# EAGLE design irs-takachi (EAGLE 7.6.0)
CNAME: IRS sensor (RFM69HW); CREVISION: 1; DESIGNER: Dariusz Mazur
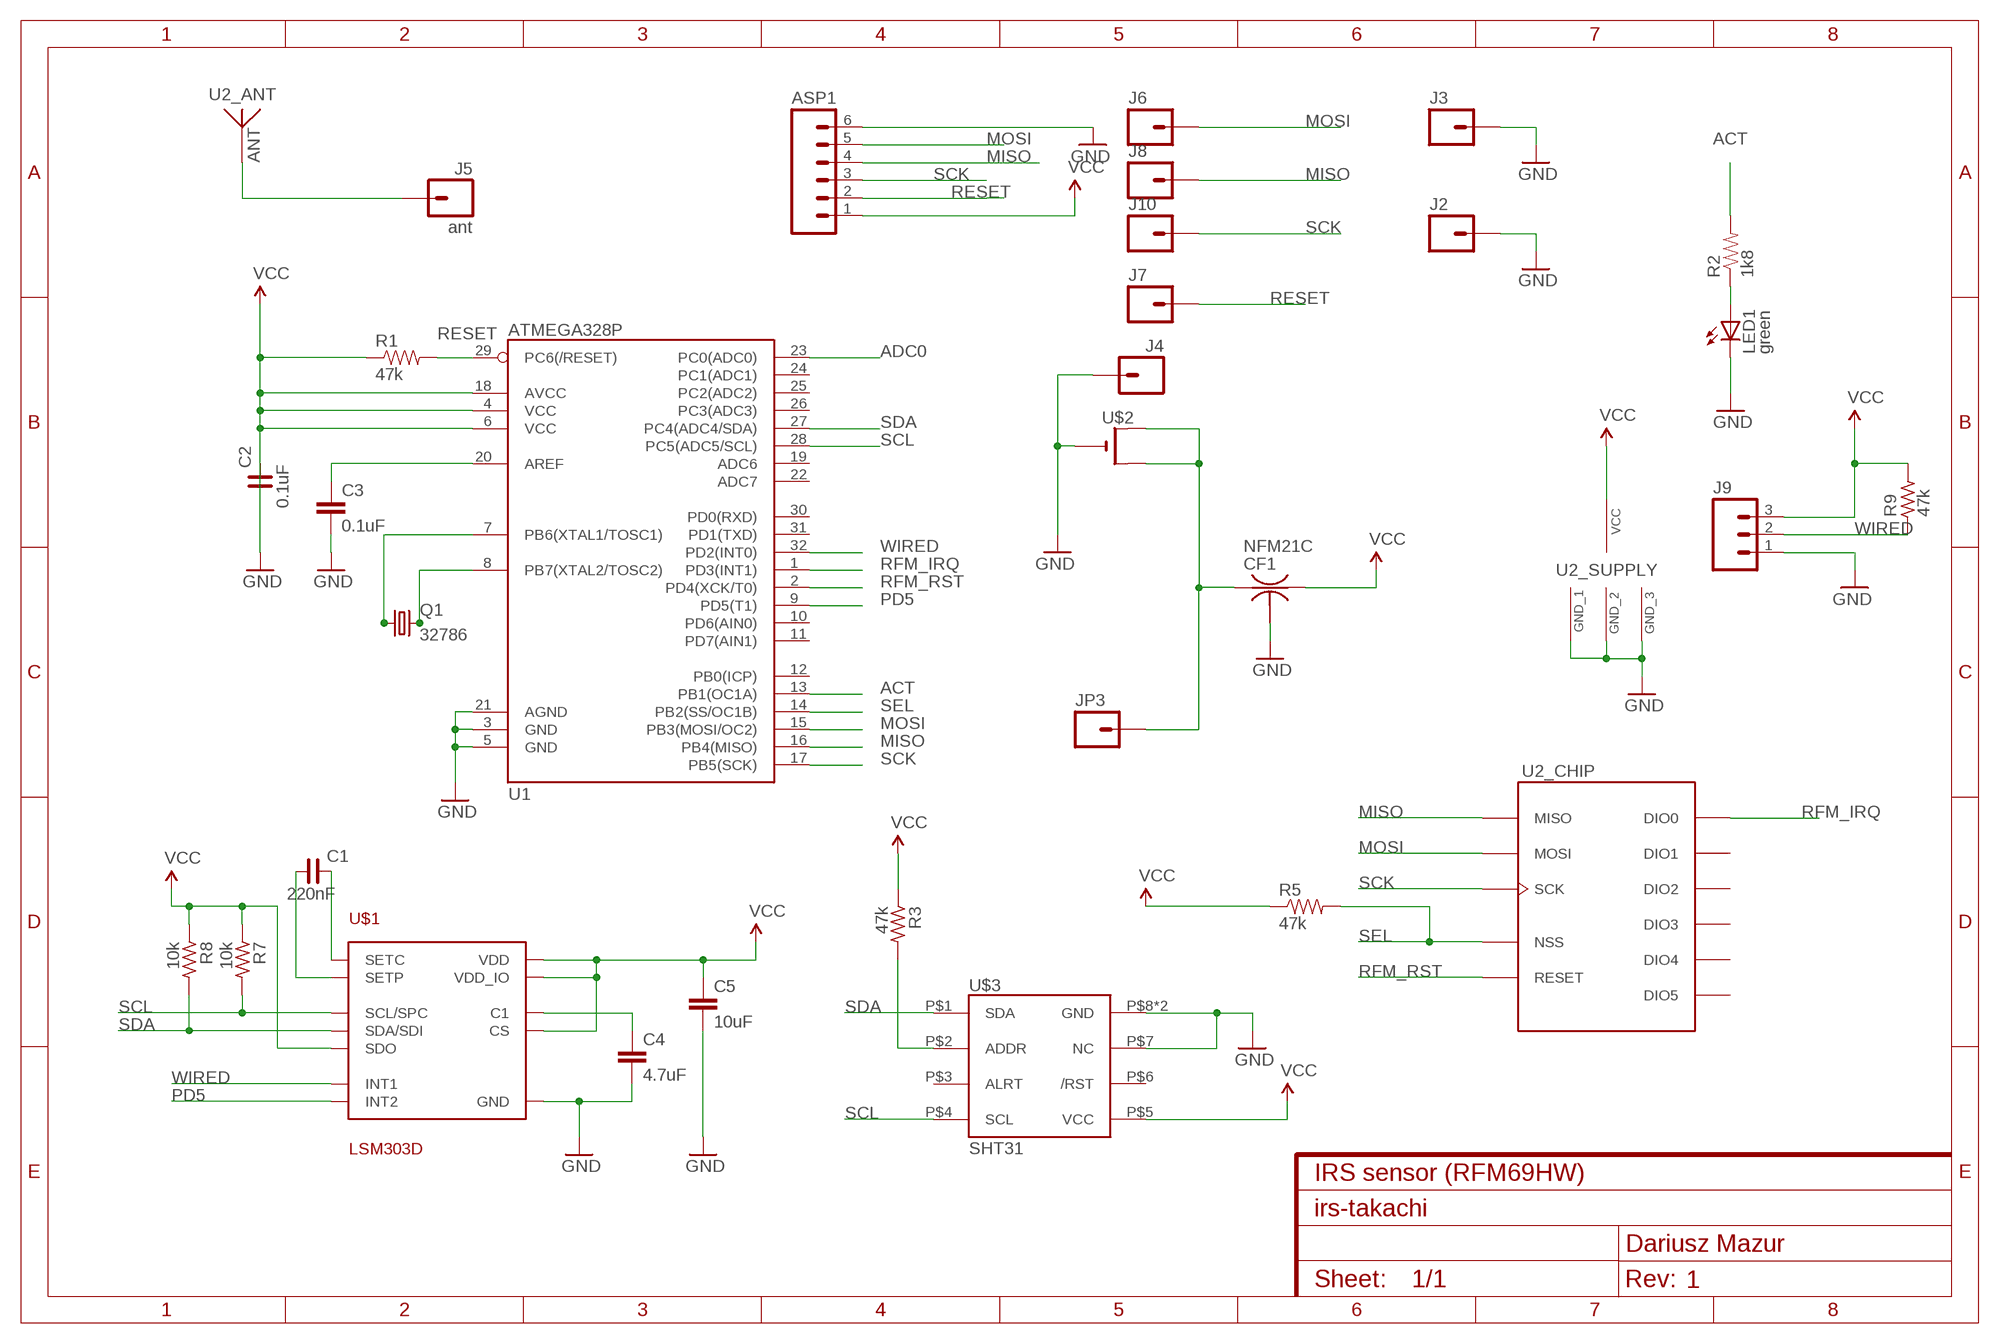
[diagram p0: schematic, sheet 1]

## Parts
ASP1  M06NO_SILK_YES_STOP  [1X06_NO_SILK_YES_STOP]
C1  220nF  C_0603  [C0603]
C2  0.1uF  C_0603  [C0603]
C3  0.1uF  0.1UF-25V(+80/-20%)(0603)  [0603-CAP]
C4  4.7uF  C-EUC0603K  [C0603K]
C5  10uF  10UF10V10%(0805)  [0805-CAP]
CF1  NFM21C  [NFM21C]
J2  M01PTH_NO_SILK_YES_STOP  [1X01_NO_SILK]
J3  M01PTH_NO_SILK_YES_STOP  [1X01_NO_SILK]
J4  M01SNAP-FEMALE  [SNAP-FEMALE]
J5  ant  M01PTH_NO_SILK_YES_STOP  [1X01_NO_SILK]
J6  M01SMD-4.5X1.5  [PAD-1.5X4.5]
J7  M01SMD-4.5X1.5  [PAD-1.5X4.5]
J8  M01SMD-4.5X1.5  [PAD-1.5X4.5]
J9  M031X03_NO_SILK  [1X03_NO_SILK]
J10  M01SMD-4.5X1.5  [PAD-1.5X4.5]
JP3  M01SMDNS  [1X01NS]
LED1  green  LED0603  [LED-0603]
Q1  32786  MC-306  [MC-306]
R1  47k  RESISTOR0603-RES  [0603-RES]
R2  1k8  RESISTOR0603-RES  [0603-RES]
R3  47k  R_0603  [R0603]
R5  47k  RESISTOR0603-RES  [0603-RES]
R7  10k  R_0603  [R0603]
R8  10k  R_0603  [R0603]
R9  47k  R_0603  [R0603]
U1  ATMEGA328P  ATMEGA328_SMT  [TQFP32-08]
U2  RFM69HCW-S2  [HOPE-RF-16]
U$1  LSM303D  [LGA16-3MM]
U$2  CR2032THM  [CR2032-THRU]
U$3  SHT31  SHT31-DIS  [SHT3X]

## Nets
ACT: R2.2 U1.13(PB1(OC1A))
ADC0: U1.23(PC0(ADC0))
GND: ASP1.6 C2.2 C3.2 C4.2 C5.2 CF1.2@1 J2.1 J3.1 J4.1 J9.1 LED1.C U1.3(GND) U1.5(GND) U1.21(AGND) U2.GND1(_SUPPLY:GND_1) U2.GND2(_SUPPLY:GND_2) U2.GND3(_SUPPLY:GND_3) U$1.5(GND) U$1.10(GND) U$1.12(GND) U$1.13(GND) U$1.16(GND) U$2.- U$3.P$7(NC) U$3.P$8(GND) U$3.PAD(GND)
MISO: ASP1.4 J8.P$1 U1.16(PB4(MISO)) U2.MISO(_CHIP:MISO)
MOSI: ASP1.5 J6.P$1 U1.15(PB3(MOSI/OC2)) U2.MOSI(_CHIP:MOSI)
N$1: LED1.A R2.1
N$2: CF1.1 JP3.1 U$2.+1(+) U$2.+2(+1)
N$3: J5.1 U2.ANT(_ANT:ANT)
N$4: C3.1 U1.20(AREF)
N$5: Q1.1 U1.7(PB6(XTAL1/TOSC1))
N$6: Q1.4 U1.8(PB7(XTAL2/TOSC2))
N$12: C1.1 U$1.3(SETP)
N$13: C1.2 U$1.2(SETC)
N$14: C4.1 U$1.15(C1)
N$15: R3.2 U$3.P$2(ADDR)
PD5: U1.9(PD5(T1)) U$1.9(INT2)
RESET: ASP1.2 J7.P$1 R1.2 U1.29(PC6(/RESET))
RFM_IRQ: U1.1(PD3(INT1)) U2.DIO0(_CHIP:DIO0)
RFM_RST: U1.2(PD4(XCK/T0)) U2.RESET(_CHIP:RESET)
SCK: ASP1.3 J10.P$1 U1.17(PB5(SCK)) U2.SCK(_CHIP:SCK)
SCL: R7.2 U1.28(PC5(ADC5/SCL)) U$1.4(SCL/SPC) U$3.P$4(SCL)
SDA: R8.2 U1.27(PC4(ADC4/SDA)) U$1.6(SDA/SDI) U$3.P$1(SDA)
SEL: R5.2 U1.14(PB2(SS/OC1B)) U2.NSS(_CHIP:NSS)
VCC: ASP1.1 C2.1 C5.1 CF1.3 J9.3 R1.1 R3.1 R5.1 R7.1 R8.1 R9.2 U1.4(VCC) U1.6(VCC) U1.18(AVCC) U2.3.3V(_SUPPLY:VCC) U$1.1(VDD_IO) U$1.7(SDO) U$1.8(CS) U$1.14(VDD) U$3.P$5(VCC)
WIRED: J9.2 R9.1 U1.32(PD2(INT0)) U$1.11(INT1)
Unconnected: CF1.2@2 U1.10(PD6(AIN0)) U1.11(PD7(AIN1)) U1.12(PB0(ICP)) U1.19(ADC6) U1.22(ADC7) U1.24(PC1(ADC1)) U1.25(PC2(ADC2)) U1.26(PC3(ADC3)) U1.30(PD0(RXD)) U1.31(PD1(TXD)) U2.DIO1(_CHIP:DIO1) U2.DIO2(_CHIP:DIO2) U2.DIO3(_CHIP:DIO3) U2.DIO4(_CHIP:DIO4) U2.DIO5(_CHIP:DIO5) U$3.P$3(ALRT) U$3.P$6(/RST)

## Library data of the parts
ASP1 = SparkFun-Connectors:M06: Header 6 Standard 6-pin 0.1" header. Use with straight break away headers (SKU : PRT-00116), right angle break away headers (PRT-00553), swiss pins (PRT-00743), machine pins (PRT-00117), and female headers (PRT-00115). Molex polarized connector foot print use with SKU : PRT-08094 with associated crimp pins and housings. NOTES ON THE VARIANTS LOCK and LOCK_LONGPADS... This footprint was designed to help hold the alignment of a through-hole component (i.e. 6-pin header) while soldering it into place. You may notice that each hole has been shifted either up or down by 0.005 of an inch from it's more standard position (which is a perfectly straight line). This slight alteration caused the pins (the squares in the middle) to touch the edges of the holes. Because they are alternating, it causes a "brace" to hold the component in place. 0.005 has proven to be the perfect amount of "off-center" position when using our standard breakaway headers. Although looks a little odd when you look at the bare footprint, once you have a header in there, the alteration is very hard to notice. Also,if you push a header all the way into place, it is covered up entirely on the bottom side. This idea of altering the position of holes to aid alignment will be further integrated into the Sparkfun Library for other footprints. It can help hold any component with 3 or more connection pins.
C1 C2 = rc-master-smd:C_: NON-POLARIZED CAP
C3 = SparkFun-Capacitors:0.1UF-25V(+80/-20%)(0603): CAP-00810 Ceramic Standard decoupling cap; PROD_ID: CAP-00810
C4 = resistor:C-EU: CAPACITOR, European symbol
C5 = SparkFun-Capacitors:10UF10V10%(0805): CAP-11330; PROD_ID: CAP-11330
CF1 = murata-filter:NFM: EMIFIL(R) (Capacitor type) Single Circuit Type for Signal Lines Source: http://search.murata.co.jp/Ceramy/image/img/PDF/ENG/L0111S0109NFM3DC.pdf; MPN: NFM21CC102R1H3D; OC_FARNELL: 1828795; OC_NEWARK: 84R0165
J2-J8 J10 JP3 = SparkFun-Connectors:M01: Header 1 Standard 1-pin 0.1" header. Use with straight break away headers (SKU : PRT-00116), right angle break away headers (PRT-00553), swiss pins (PRT-00743), machine pins (PRT-00117), and female headers (PRT-00115). SMTSO-256-ET is a "flush mount" nut for a 4-40 screw. The older package used to be too tight, and did not allow it to sit properly thru the drill hit. The latest (0.165DIA) fits nice and snug.
J9 = SparkFun-Connectors:M03: Header 3 Standard 3-pin 0.1" header. Use with straight break away headers (SKU : PRT-00116), right angle break away headers (PRT-00553), swiss pins (PRT-00743), machine pins (PRT-00117), and female headers (PRT-00115). Molex polarized connector foot print use with SKU : PRT-08232 with associated crimp pins and housings.
LED1 = SparkFun-LED:LED: LEDs Standard schematic elements and footprints for 5mm, 3mm, 1206, and 0603 sized LEDs. 5mm - Spark Fun Electronics SKU : COM-00529 (and others)
Q1 = crystal:MC-306: kHz RANGE CRYSTAL UNIT SMD Source: MC-306_405_406_E07X.PDF Homepage <http://www.epsontoyocom.co.jp>; MPN: MC-306 60.0KHZ 100PPM ,12.5PF; OC_FARNELL: 1278040; OC_NEWARK: 31M5576
R1 R2 R5 = SparkFun-Passives:RESISTOR: Resistor Basic schematic elements and footprints for 0603, 1206, and PTH resistors.
R3 R7-R9 = rc-master-smd:R_: RESISTOR
U1 = SparkFun-DigitalIC:ATMEGA328_SMT: 32-Pin Atmega328 part Commonly used on Arduino compatible boards Available in QFP and QFN packages TQFP is IC-09069 QFN is non-stock; PROD_ID: IC-09069
U2 = icmi-custom-parts:RFM69HCW: HopeRF RFM69HCW ISM Transceiver Module The RFM69HCW <http://www.hoperf.com/rf/fsk_module/RFM69HCW.htm> is a transceiver module capable of operation over a wide frequency range, including the 315,433,868 and 915MHz license-free ISM (Industry Scientific and Medical) frequency bands. All major RF communication parameters are programmable and most of them can be dynamically set. The RFM69HCW offers the unique advantage of programmable narrow-band and wide- band communication modes. The RFM69HCW is optimized for low power consumption while offering high RF output power and channelized operation. Compliance ETSI and FCC regulations. In order to better use RFM69HCW modules, this specification also involves a large number of the parameters and functions of its core chip RF69H's,including those IC pins which are not leaded out. All of these can help customers gain a better understanding of the performance of RFM69HCW modules, and enhance the application skills.
U$1 = pimoroni-ics:LSM303D
U$2 = adafruit:CR2032
U$3 = thomasb9511:SHT31-DIS

## Board
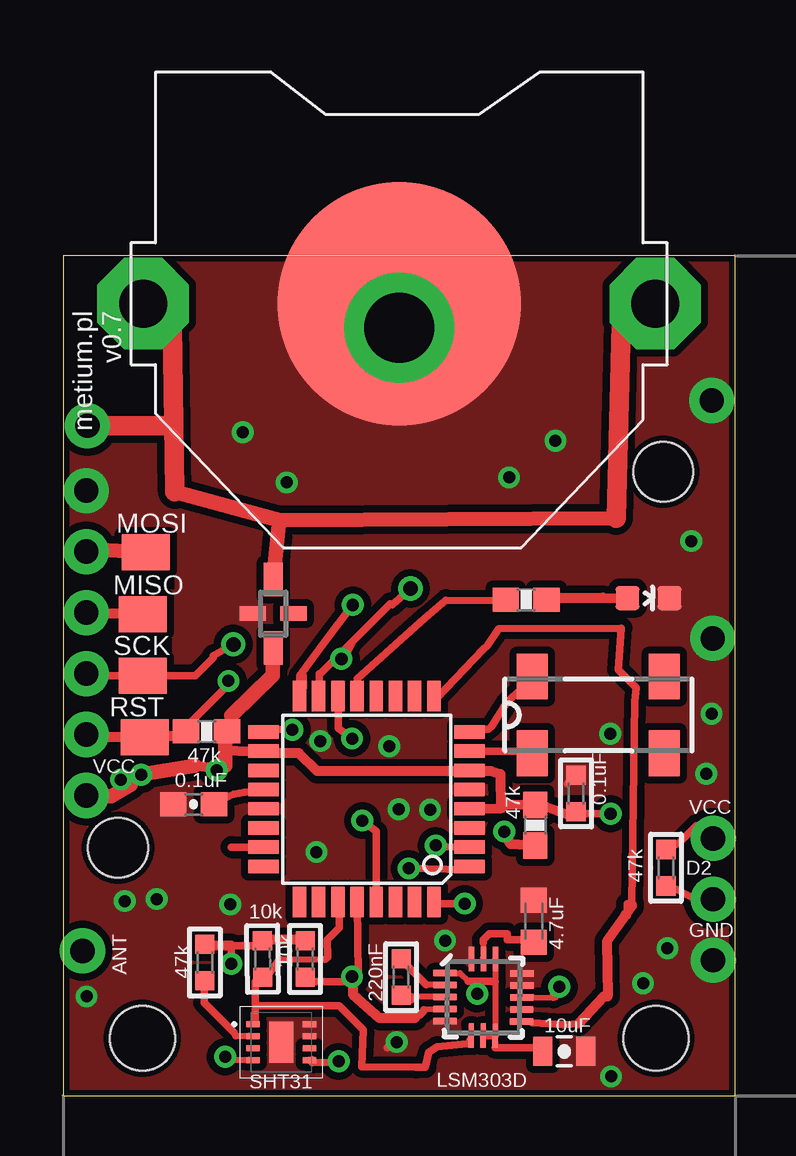
[diagram p1: board, top side]
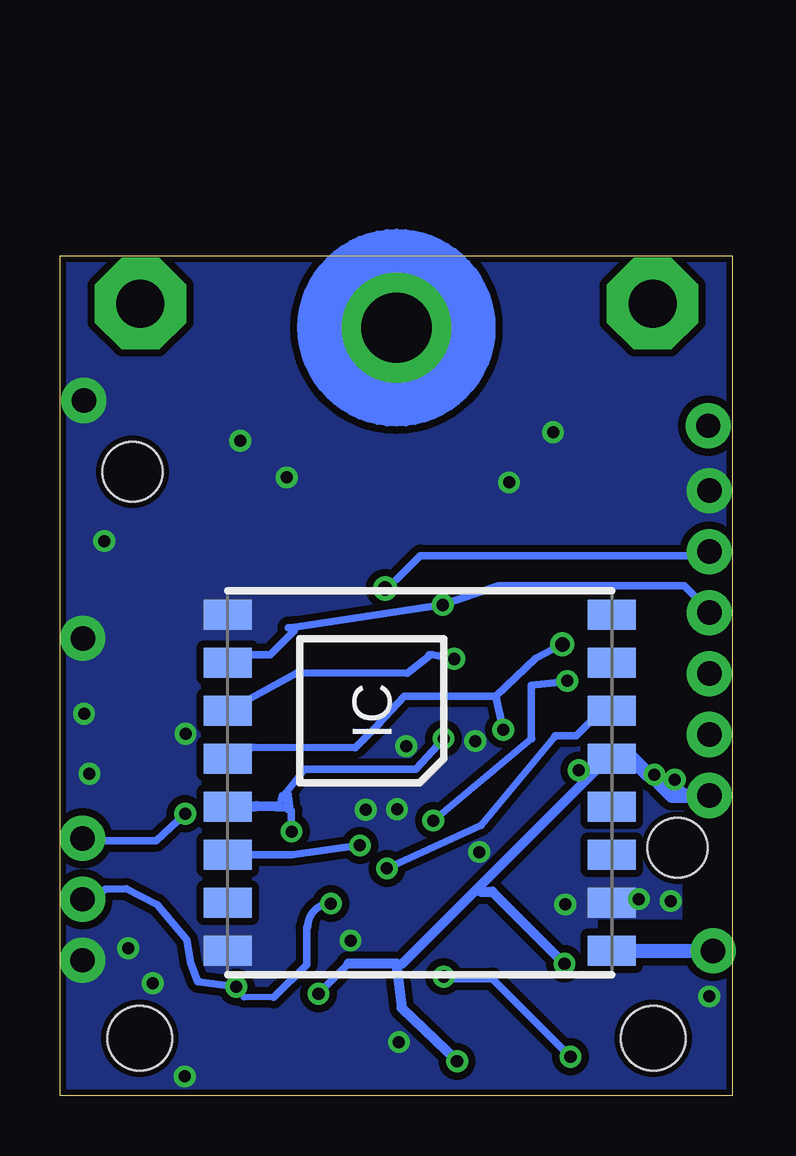
[diagram p2: board, bottom side, seen from below]

Size 28 x 35 mm. Coordinates in mm from the lower left corner, seen from the top.
Outline: 0,0 28,0 28,35 0,35 0,0
Copper layers (1*16): Top 0.035mm / dielectric 1.5mm / Bottom 0.035mm
Design rules "dirt_cheap_dirty_boards.v1 *": minimum track width 12mil, minimum drill 20mil, track to track 12mil, track to pad 12mil, pad to pad 10mil, via to via 12mil, smd to smd 0mil, copper to edge 10mil, drill to drill 12mil, minimum pad ring 12mil, minimum via ring 8mil, stop-mask expansion 2mil, vias tented up to drill 25mil, thermal gap 10mil
Holes 2.5 mm at 25,26 2.28,10.33
Holes 2.7 mm at 3.3,2.4 24.7,2.4
tRestrict: area 2.4,21.1 to 4.6,21.7; area 2.3,18.5 to 4.5,19.1; area 24.6,9.3 to 25.9,9.6
bRestrict: area 20,8.8 to 22.1,9.2; area 19.6,12.9 to 22.1,13.2; area 20.1,10.9 to 22.1,11.2; area 3.4,14.8 to 5.5,15.2; area 3.5,18.8 to 5.5,19.2; area 3.5,16.8 to 5.5,17.2; area 0,6.9 to 5.6,7.3; area 20,14.8 to 22.1,15.2; area 0,6.3 to 2.1,11; area 20,16.8 to 22.1,17.2

### Footprints (pad centres in the part's own frame; a part is rotated, then mirrored left to right if it is on the bottom)
1X06_NO_SILK_YES_STOP = drill 1.016 pad 1.88: 1 0,0; 2 2.54,0; 3 5.08,0; 4 7.62,0; 5 10.16,0; 6 12.7,0
C0603 = smd 0.8 x 0.8: 1 -0.762,0; 2 0.762,0
0603-CAP = smd 1.1 x 1: 1 -0.85,0; 2 0.85,0
C0603K = smd 1.05 x 1.08: 1 -0.875,0; 2 0.875,0
0805-CAP = smd 0.8 x 1.2: 1 -0.9,0; 2 0.9,0
NFM21C = smd 1.4 x 0.8: 1 -1.425,0; 3 1.425,0 | smd 0.6 x 1.1: 2@1 0,-0.85; 2@2 0,0.85
1X01_NO_SILK = drill 1.016 pad 1.88: 1 0,0
SNAP-FEMALE = drill 2.921 pad 4.572: 1 0,0
PAD-1.5X4.5 = smd 1.5 x 2: P$1 0,0
1X03_NO_SILK = drill 1.016 pad 1.88: 1 0,0; 2 2.54,0; 3 5.08,0
1X01NS = drill 1.016 pad 1.88: 1 0,0
LED-0603 = smd 1 x 1: A 0,-0.877; C 0,0.877
MC-306 = smd 1.3 x 1.9: 1 -2.75,-1.6; 2 2.75,-1.6; 3 2.75,1.6; 4 -2.75,1.6
0603-RES = smd 1.1 x 1: 1 -0.85,0; 2 0.85,0
R0603 = smd 0.8 x 0.8: 1 -0.762,0; 2 0.762,0
TQFP32-08 = smd 1.27 x 0.559: 1 -4.293,2.8; 2 -4.293,2; 3 -4.293,1.2; 4 -4.293,0.4; 5 -4.293,-0.4; 6 -4.293,-1.2; 7 -4.293,-2; 8 -4.293,-2.8; 17 4.293,-2.8; 18 4.293,-2; 19 4.293,-1.2; 20 4.293,-0.4; 21 4.293,0.4; 22 4.293,1.2; 23 4.293,2; 24 4.293,2.8 | smd 0.559 x 1.27: 9 -2.8,-4.293; 10 -2,-4.293; 11 -1.2,-4.293; 12 -0.4,-4.293; 13 0.4,-4.293; 14 1.2,-4.293; 15 2,-4.293; 16 2.8,-4.293; 25 2.8,4.293; 26 2,4.293; 27 1.2,4.293; 28 0.4,4.293; 29 -0.4,4.293; 30 -1.2,4.293; 31 -2,4.293; 32 -2.8,4.293
HOPE-RF-16 = smd 1.25 x 2: 3.3V 1,-8; ANT -7,-8; DIO0 3,-8; DIO1 5,-8; DIO2 7,-8; DIO3 -3,-8; DIO4 -1,-8; DIO5 -5,8; GND1 7,8; GND2 -7,8; GND3 -5,-8; MISO 5,8; MOSI 3,8; NSS -1,8; RESET -3,8; SCK 1,8
LGA16-3MM = smd 1 x 0.25: 1 -1.6,1; 2 -1.6,0.5; 3 -1.6,0; 4 -1.6,-0.5; 5 -1.6,-1; 9 1.6,-1; 10 1.6,-0.5; 11 1.6,0; 12 1.6,0.5; 13 1.6,1 | smd 0.25 x 1: 6 -0.5,-1.6; 7 0,-1.6; 8 0.5,-1.6; 14 0.5,1.6; 15 0,1.6; 16 -0.5,1.6
CR2032-THRU = drill 2 pad 3.81 octagon: +1 -10.668,0; +2 10.668,0 | smd 10.16 x 10.16: - 0,0
SHT3X = smd 0.55 x 0.25: P$1 -1.175,0.75; P$2 -1.175,0.25; P$3 -1.175,-0.25; P$4 -1.175,-0.75; P$5 1.175,-0.75; P$6 1.175,-0.25; P$7 1.175,0.25; P$8 1.175,0.75 | smd 1 x 1.7: PAD 0,0

### Placement (x,y rotation side)
ASP1  0.96,12.51 90 bottom
C1  14.08,4.94 90 top
C2  21.37,12.6 90 top
C3  5.43,12.15 180 top
C4  19.61,7.27 90 top
C5  20.88,1.85 0 top
CF1  8.75,20.09 270 top
J2  27.07,19.06 90 top
J3  27.03,28.97 0 top
J4  14,32 0 bottom
J5  0.81,6.04 0 top
J6  3.45,22.64 90 top
J7  3.41,14.93 90 top
J8  3.32,20.05 90 top
J9  27.08,5.64 90 top
J10  3.31,17.49 90 top
JP3  1.01,27.91 90 top
LED1  24.39,20.73 270 top
Q1  22.3,15.87 0 top
R1  5.97,15.18 180 top
R2  19.29,20.67 180 top
R3  5.9,5.55 270 top
R5  19.67,11.27 270 top
R7  10.08,5.7 270 top
R8  8.31,5.7 270.7 top
R9  25.12,9.5 90 top
U1  12.65,12.36 180 top
U2  13.03,13.04 90 bottom
U$1  17.51,4.1 359.7 top
U$2  14,33 0 top
U$3  9.09,2.23 0 top

### Tracks (layer width: path | path; a pad name or v marks a point on that pad's centre or on a via)
ACT
  Top 0.305: R2.2 18.5,20.62 15.94,20.65 15.06,19.9 12.25,17.38 12.25,16.75 U1.13
ADC0
  Top 0.305: 8.2,10.37 U1.23 7.01,10.36
GND  (via drill 0.5, 0.5 pad 0.25)
  Top 0.305: U1.21 | 21,13 C2.2 | 13.5,2 v13.9,2.24
  other vias: 2.57,8.11 0.97,4.14 6.96,7.97 26.17,23.11 13.98,11.94 27.02,15.91 15.28,11.91 22.79,15.09 10.55,10.15 13.59,14.57 10.71,14.78 7.48,27.64 26.79,13.42 25.17,6.14 24.16,4.69 15.91,6.46 20.51,27.29 22.83,0.8 3.9,8.19 18.58,25.76 9.31,25.55
  pour Bottom (rank 6, no thermals): 0,35 28,35 28,0 0,0
  pour Top (rank 6, no thermals): 0,0 28,0 28,35 0,35
MISO  (via drill 0.51)
  Top 0.305: 9.85,17.5 10.89,18.91 v12.07,20.45 | 9.85,17.5 9.85,17.14 | J8.P$1 3.5,20.25 3.43,20.1 | 1,20.12 ASP1.4 1,20 1,20.1 | U1.16 10,17 10,17.5 9.85,17.5
  Top 0.406: 0.93,20.1 1,20.1 3.43,20.1
  Bottom 0.305: 18.5,19.5 18.27,19.52 | 18.27,19.52 v12.07,20.45 9.75,21.25 2,21.25 1,20.25 ASP1.4 | U2.MISO 20.88,18.25 20.75,18.38 19.25,18.38 18.25,19.38 18.27,19.52
MOSI  (via drill 0.51, 0.6)
  Top 0.305: v14.47,21.13 13.71,20.45 13.62,20.5 12.06,18.94 | U1.15 10.68,17.59 10.75,17.62 12.06,18.94 | 1.41,22.75 1.12,22.75 1,22.75 ASP1.5 | 12.06,18.94 11.84,18.46 v11.59,18.2
  Top 0.61: J6.P$1 1.49,22.74 1.41,22.75
  Bottom 0.254: 1,22.5 ASP1.5
  Bottom 0.305: U2.MOSI 18.14,17.63 13.56,17.6 12.7,18.27 12.62,18.38 12.5,18.38 v11.59,18.2 | v14.47,21.13 14,21.5 13,22.5 1,22.5
N$1
  Top 0.305: 20.25,20.75 R2.1
  Top 0.406: 20.25,20.75 22.5,20.75 LED1.A
N$2
  Top 0.305: 4.5,28 4.62,27.88 | 4.5,28 4.5,27.91 | 4.5,28 4.61,28
  Top 0.406: 4.54,32.09 4.83,32.11 4.83,32.29 3.86,32.29 U$2.+1 | 25.2,32.02 U$2.+2
  Top 0.61: 8.99,23.97 CF1.1 | 8.99,23.97 4.65,25.16 | 8.99,23.97 23.04,24.07 | 23.26,32.16 25.2,32.02
  Top 0.813: 4.65,25.16 4.61,28 4.54,32.09 | 23.04,24.07 23.26,32.16 | JP3.1 4.5,27.91 4.61,27.91
N$3
  Top 0.406: 0.81,6.11 J5.1
  Bottom 0.61: U2.ANT 0.81,6.02 J5.1
N$4
  Top 0.305: U1.20 7.56,12.65 arc27 C3.1
N$5
  Top 0.305: U1.7 19.29,14.36 Q1.1
N$6
  Top 0.305: U1.8 16.95,15.27 17.7,15.27 17.86,15.4 18.49,16.41 19.45,17.27 Q1.4
N$11
  Top 0.254: 3.25,13.69 2.82,12.96
  Top 0.61: 2.82,12.96 2,12.48 0.98,12.47
N$12
  Top 0.254: 14.5,4.12 15.88,4.12 U$1.3
  Top 0.305: C1.1 14,4 14.5,4 14.5,4.12
N$13
  Top 0.254: 15.12,4.62 15.88,4.62 U$1.2
  Top 0.305: 15.12,4.62 14.12,5.62 14.12,5.75 C1.2
N$14
  Top 0.254: 17.5,6.38 17.5,5.75 U$1.15
  Top 0.305: 17.5,6.38 17.5,6.5 17.75,6.75 18.5,6.75 18.5,6.5 19.5,6.5 C4.1
N$15
  Top 0.254: 7.18,2.5 7.75,2.5 U$3.P$2
  Top 0.305: 6,4.88 R3.2 5.88,4.75 5.88,3.88 7.12,2.62 7.18,2.5
PD5
  Top 0.254: 19.54,3.04 U$1.9
  Top 0.305: 23.6,8.01 23.6,8 | 23.6,8 23.6,7.92 | U1.9 15.5,16.62 15.56,16.55 17.5,18.6 17.66,18.75 18.14,19.47 23.25,19.49 23.12,17.75 23.88,17 23.81,16.45 23.69,8 23.5,8 | 19.54,3.04 20.87,2.96 21.48,3 | 22.52,4.13 22.68,4.13 | 23.5,8 23.6,8 | 23.5,8 23.5,7.5 23.44,7.54
  Top 0.406: 23.69,8 23.68,7.88 | 22.68,4.13 22.66,6.43 23.44,7.54 23.69,7.91 | 22.52,4.13 21.48,3
RESET  (via drill 0.5)
  Top 0.305: v12.46,11.46 13.05,11.01 13.05,8.56 U1.29 | ASP1.2 1,15 1,14.94 | 6.88,17.25 v6.89,17.28 6.88,17.12 5.12,15.38 5.12,15.25 R1.2 5.12,15.12 5,15 | 3.5,15 J7.P$1
  Top 0.406: J7.P$1 1,14.94 0.9,14.94 | 3.5,15 5,15
  Bottom 0.305: 8.37,14.88 8.38,14.87 | 8.38,14.87 v12.46,11.46 | v6.89,17.28 7,17.25 8.39,17.09 8.38,14.88 8.38,14.87
RFM_IRQ  (via drill 0.5)
  Top 0.305: v14.4,9.47 16.77,9.41 U1.1
  Bottom 0.254: 5.5,16 U2.DIO0
  Bottom 0.305: v14.4,9.47 14.15,9.57 10.48,11.27 7.42,14.94 7.38,15 6.5,15 5.5,16
RFM_RST  (via drill 0.5)
  Top 0.305: v15.52,10.43 15.95,10.38 16.69,10.34 17.04,10.36 U1.2
  Bottom 0.305: v15.52,10.43 18.33,10.04 U2.RESET
SCK  (via drill 0.5, 0.6)
  Top 0.305: v9.55,15.25 8.45,15.27 U1.17 | 3.5,17.5 1,17.5 ASP1.3 | v7.09,18.8 6.24,18.34 6.25,18.25 5.5,17.5 3.5,17.5 | 3.5,17.5 J10.P$1
  Bottom 0.305: 9.86,16.64 8.19,18.23 v7.09,18.8 | 9.86,16.64 v9.55,15.25 | U2.SCK 19.95,14.52 15.72,14.5 14.72,15.5 14.75,15.47 13.67,16.64 9.86,16.64
SCL  (via drill 0.51)
  Top 0.254: U$3.P$4 7.75,1.5 7,1.5 | U$1.4 15.02,3.58
  Top 0.305: 12.12,4.75 12,4.75 | 12,4.75 10.12,4.75 10.12,4.88 R7.2 | U1.28 12.25,8.12 12.25,8 12.29,5 12.25,5 12.12,5 v12.03,4.97 12,4.88 12,4.75 | 15.02,3.58 15,3.5 14.88,3.38 14.75,3.38 | v6.75,1.62 6.88,1.5 7,1.5 | 14.75,3.38 14.75,3.37 | 14.75,3.38 14.66,3.23
  Top 0.406: 14.51,3.26 14.75,3.37 14.79,3.39 | 14.66,3.23 13.19,3.23 12.08,4.21 12.08,4.92 v12.03,4.97
  Bottom 0.305: v6.75,1.62 10,4.88 12,4.88 | 12.25,4.88 12,4.88 | v12.03,4.97 12,5 12,4.88
SDA
  Top 0.254: 8,3 U$3.P$1 | 16.84,2.16 U$1.6 | 9.02,5.69 10.91,5.69
  Top 0.305: 8,3.75 8,4.75 8.12,4.75 R8.2 8.25,4.88 8.38,5 8.5,5 9.02,5.69 | 8,3.75 8,3 | 8,3.75 11.5,3.75 12.5,2.75 12.45,1.22 14.69,1.18 15.09,1.19 15.24,1.81 15.58,2.04 16.84,2.16 | 10.91,5.69 11.02,5.77 11,6.5 11.5,7 11.5,8 U1.27
SEL  (via drill 0.5)
  Top 0.305: v12.04,14.88 11.46,15.32 11.46,16.52 11.45,16.52 U1.14
  Top 0.406: R5.2 18.64,10.48 v18.37,11.01
  Bottom 0.305: v12.04,14.88 13.19,13.6 17.82,13.6 18.72,12.47 | 18.81,12.36 18.72,12.47 | U2.NSS 19.83,12.03 19.08,12.02 19,12 | 19,12 18.97,12.04 | 18.75,12 18.5,12 18.52,12 18.38,11.88 18.38,11.12 v18.37,11.01 | 18.75,12 18.92,12.08 19,12 | 18.57,12.52 18.75,12.5 18.72,12.47 | 19,12 18.95,12.02 | 18.75,12 19,12
  Bottom 0.406: U2.NSS 20.45,11.96 | 20.71,12.06 19.83,12.07 18.92,12.08 | 18.57,12.58 18.57,12.52 18.52,12
VCC  (via drill 0.5, 0.51)
  Top 0.254: 18,2.38 U$1.8 | U$1.14 18,5.7 18,4.75 U$1.8 | U$1.1 16.52,5.11 16.87,4.76 | 18,2 18,2.25 U$1.8 | 17.55,2.51 U$1.7
  Top 0.305: 6.82,14.38 6.88,15.12 6.88,15.25 | 16.87,4.76 17.25,4.76 | 17.25,4.76 17.88,4.76 | 17.88,4.76 17.94,4.76 | v17.25,4.25 17.25,4.76 | 10.38,1.38 11.07,1.4 v11.48,1.43 | 10.38,1.38 | v7,5.5 7,6.25 7.88,6.25 R8.1 8.12,6.38 8.29,6.5 | 25.5,10.5 R9.2 25.62,10.5 26.38,11.25 27,10.62 J9.3 | 21.5,12 C2.1 | 21.38,11.75 21.25,11.75 21.2,11.65 21.38,11.75 | 19.75,12.14 19.75,12.25 R5.1 19.88,12 19.92,12.12 | 18.5,12.13 18.5,12.25 18.41,12.1 | 20,2 C5.1 19.88,2 18,2 | R3.1 6,6.38 6,6.25 | 7.01,15.83 6.88,15.62 6.88,15.38 R1.1 6.88,15.25 | 6.38,13.62 v6.4,13.56 | 6.38,13.62 | 21.38,11.75 C2.1 | v3.25,13.38 3.25,13.5 3.43,13.42 | CF1.3 9,18.5 8.73,18.5 | 17,13.5 17,13.52 16.88,13.5 U1.6 17,13.5 | 6.88,15.25 6.75,15.12 | 8.19,14.32 8.25,14.38 U1.18 | U$3.P$5 10.38,1.5 10.38,1.38 | 17.88,4.76 17.88,4.75 18,4.75 | v22.81,11.75 21.62,11.75 C2.1 | U$1.8 17.55,2.51 | R7.1 10.12,6.5 10.04,6.5 | 17,13.5 16.88,13.52 | U1.4 17,12 17,11.94
  Top 0.406: 19.87,12.14 19.92,12.12 21.2,11.65 | 18.23,11.96 18.21,13.4 17.83,13.52 17,13.52 | 18.23,11.96 18.41,12.1 | 18.34,12.13 18.5,12.13 19.33,12.14 19.75,12.14 | 18.23,11.96 17,11.94 | 16.88,13.52 10.58,13.52 9.82,14.28 8.43,14.28 U1.18 | 10.04,6.5 8.29,6.5 | 8.19,14.32 6.82,14.38 | 6.75,13.75 6.38,13.62 5.47,13.75 | 7,6.25 6,6.25
  Top 0.61: 5.47,13.75 3.43,13.42 | 6.75,15.12 6.75,13.75 | 8.73,18.52 8.73,18.5 8.73,17.52 7.01,15.83
  Bottom 0.254: 4.25,14.12 U2.3.3V 5.25,13.75 5.5,13.75 | 10.5,8.5 10.62,8.62 | 1,12.5 ASP1.1 | 2.86,13.15 v2.41,13.17
  Bottom 0.305: 4.32,14.23 U2.3.3V | 16,5.5 v17.25,4.25 | v3.25,13.38 3.25,13.5 3.5,13.38 | v22.81,11.75 24,10.62 27,10.62 J9.3 | 13.75,5.5 14,5.5
  Bottom 0.406: 5.27,13.91 U2.3.3V | 16,5.5 14,5.5 13.78,3.65 v11.48,1.43 | 5.5,13.75 10.62,8.62 13.75,5.5 | v7,5.5 10,8.5 10.5,8.5
  Bottom 0.61: 3.5,13.38 4.25,14.12 | 2,12.5 2.5,12.5 3,13 v3.25,13.38 | 2,12.5 1,12.5 | 2,12.5 2.86,13.15
WIRED  (via drill 0.5, 0.51)
  Top 0.254: 19.47,4.09 U$1.11 19.14,4.08 20.42,4.09
  Top 0.305: 15.58,8.06 U1.32 15.5,8.12 | 15.5,8.5 15.5,8.12 | R9.1 25.25,8.75 26.22,8.26 27,8.12 J9.2 | 15.5,8.12 15.5,8.01 v16.73,8.01 | 20.51,4.36 20.44,4.25 20.5,4.12 | 20.5,4.12 v20.67,4.54 | 20.5,4.12 20.42,4.09
  Bottom 0.254: 17.7,7.04 17.7,7.04 arc90 17.72,7.01 17.74,7.01 | U$1.11 20.35,4.09 v20.67,4.54
  Bottom 0.305: 26.88,8.38 27,8.25 J9.2 27,8 26.13,8.61 25.26,8.62 23.97,7.96 22.73,6.5 22.58,5.53 22.27,4.75 v20.67,4.54 | v16.73,8.01 arc-90 17.7,7.04 | 17.74,7.01 17.74,5.46 U$1.11

### Text on the board
tPlace: metium.pl / v0.7 | MOSI | MISO | SCK | RST | VCC | VCC | D2 | GND | ANT
Document: RESET | VCC